# Altium schematic sheet SWJ_v1.0.SchDoc
size 91 x 63 mm
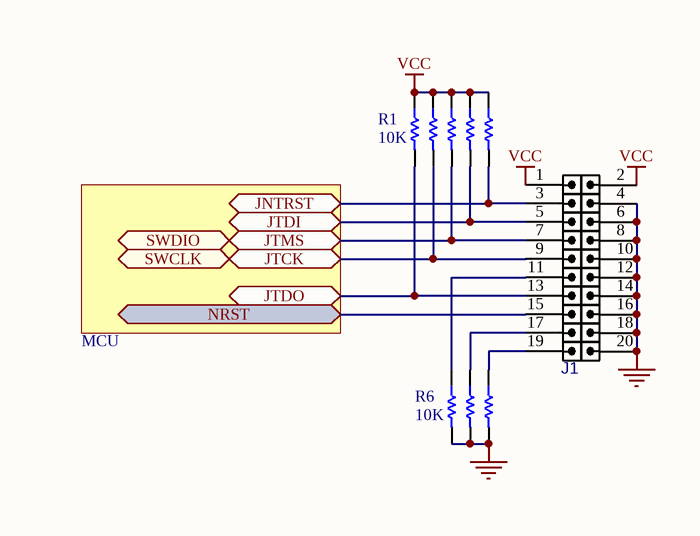
[diagram p0: SWJ_v1.0.SchDoc]

## Parts
J1  Connector_2x10Pin_Male  [IDC_THD_P2.54_2X10]  (value not drawn)
R1  10K  [SMD_0805]
R2  10K  [SMD_0805]  (value not drawn)
R3  10K  [SMD_0805]  (value not drawn)
R4  10K  [SMD_0805]  (value not drawn)
R5  10K  [SMD_0805]  (value not drawn)
R6  10K  [SMD_0805]
R7  10K  [SMD_0805]  (value not drawn)
R8  10K  [SMD_0805]  (value not drawn)

## Ports
JNTRST (bidir), JTCK (bidir), JTDI (bidir), JTDO (bidir), JTMS (bidir), NRST, SWCLK (bidir), SWDIO (bidir)

## Nets
GND: J1.4 J1.6 J1.8 J1.10 J1.12 J1.14 J1.16 J1.18 J1.20 R6.1 R7.1 R8.1
VCC: J1.1 J1.2 R1.2 R2.2 R3.2 R4.2 R5.2
JNTRST: J1.3 R5.1 ; port JNTRST
JTCK: J1.9 R2.1 ; port JTCK, port SWCLK
JTDI: J1.5 R4.1 ; port JTDI
JTDO: J1.13 R1.1 ; port JTDO
JTMS: J1.7 R3.1 ; port JTMS, port SWDIO
NRST: J1.15 ; port NRST
NetJ1_11: J1.11 R6.2
NetJ1_17: J1.17 R7.2
NetJ1_19: J1.19 R8.2

## Notes on the sheet
- MCU

## Library data of the parts
J1 = Connector_2x10Pin_Male: Connector, Header; 1_Part Number: TST-115-04-G-D-RA; 1_Manufacturer: Samtec; 1_Link: https://eu.mouser.com/ProductDetail/Samtec/TST-115-04-G-D-RA?qs=rU5fayqh%252BE1yg%2FuIccJSSw%3D%3D
R1-R8 = Resistor: Resistor, 1/4W, 5%; Revision: July-2002: Re-released for DXP Platform.